# Altium project PCB_Project1.PrjPCB
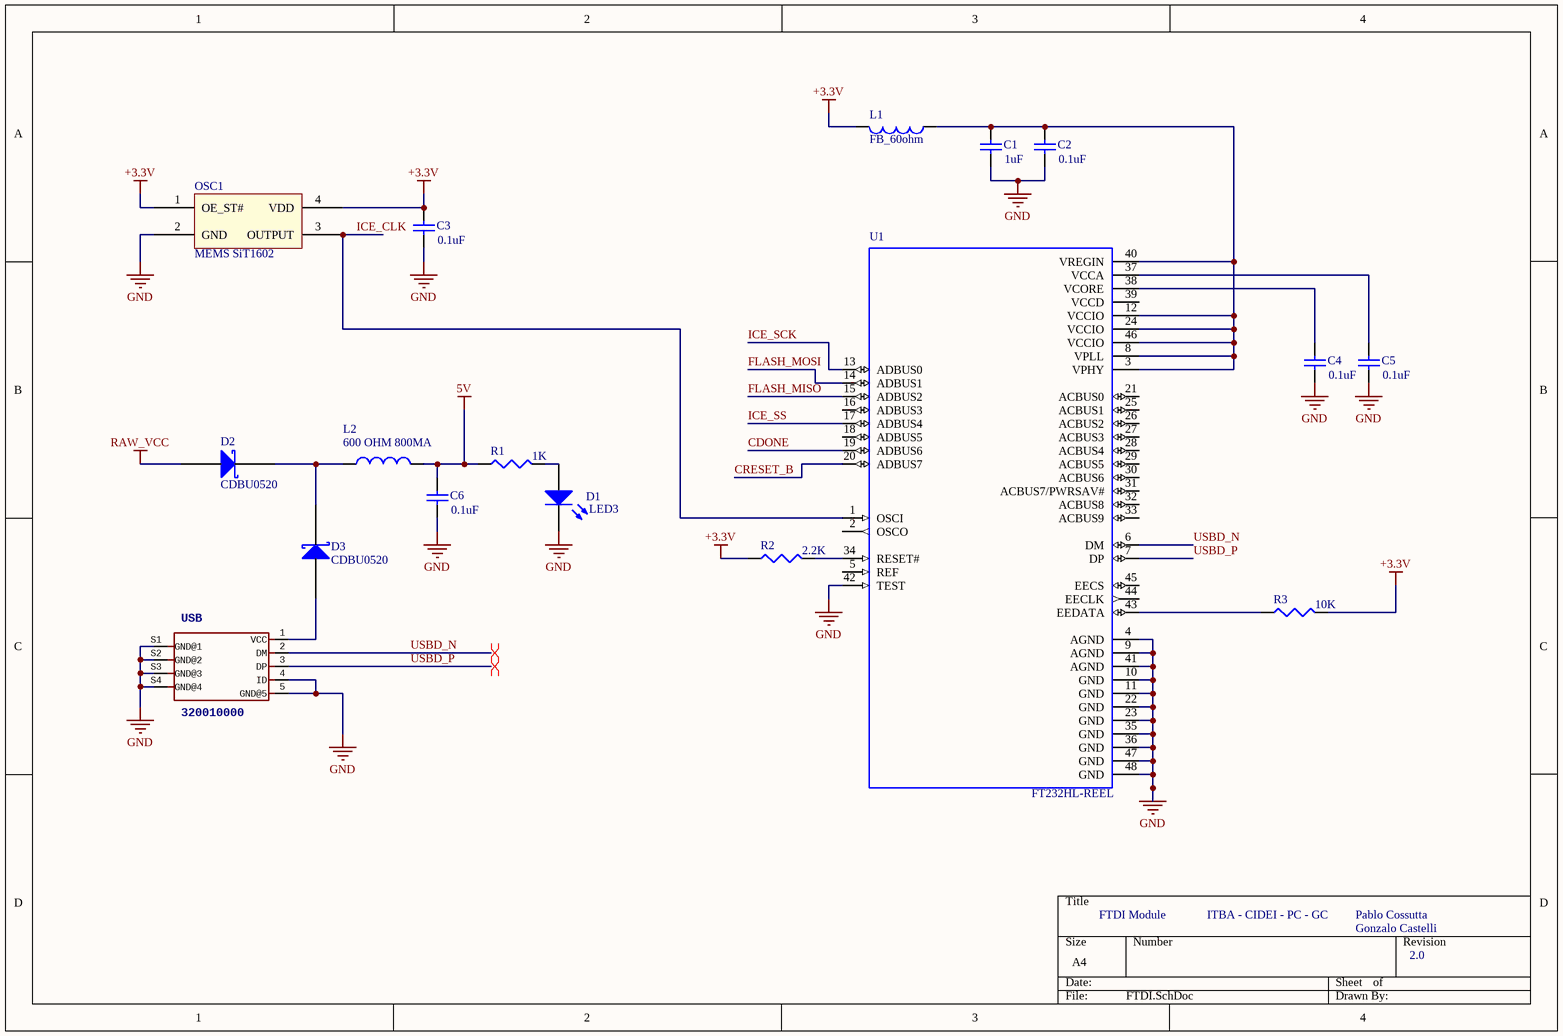
[diagram p0: FTDI.SchDoc]
3 sheets, 56 parts. Net scope: global (net labels, ports and power ports of the same name join across sheets).
Board file: FPGA.PcbDoc
Sheets:
  FTDI.SchDoc
  Misc.SchDoc
  FPGA.SchDoc

## Sheet FTDI.SchDoc
size A4; PageSetup: Record=PageOptions|CenterHorizontal=True|CenterVertical=True|PrintScale=1.00|XCorrection=1.00|YCorrection=1.00|PrintKind=2|BorderSize=5000000|LeftOffset=0|BottomOffset=0|Orientation=2|PaperLength=1000|PaperWidth=1000|Scale=100|PaperSource=7|PrintQuality=-3|MediaType=1|DitherType=10|PrintScaleMode=1|PaperKind=A4|PaperIndex=9

### Parts
C1  value 1uF  [C0402]  (hidden comment: Cap Semi)
C2  value 0.1uF  [C0402]  (hidden comment: Cap Semi)
C3  value 0.1uF  [C0402]  (hidden comment: Cap Semi)
C4  value 0.1uF  [C0402]  (hidden comment: Cap Semi)
C5  value 0.1uF  [C0402]  (hidden comment: Cap Semi)
C6  value 0.1uF  [C0402]  (hidden comment: Cap Semi)
D1  LED3  [LED-0603]
D2  CDBU0520  [CDBU0520]
D3  CDBU0520  [CDBU0520]
L1  FB_60ohm  [J1-0603]
L2  600 OHM 800MA  [J1-0603]
OSC1  MEMS SiT1602  [oscMEMS1602]
R1  value 1K  [R0402]  (hidden comment: Res3)
R2  value 2.2K  [R0402]  (hidden comment: Res3)
R3  value 10K  [R0402]  (hidden comment: Res3)
U1  FT232HL-REEL  [QFP50P900X900X160-48N]
USB  320010000  [MICRO-USB5+4P-SMD-0.65-B]

### Nets
5V: C6.2 L2.2 R1.1
+3.3V: C3.2 L1.2 OSC1.1(OE_ST#) OSC1.4(VDD) R2.1 R3.2
GND: C1.1 C2.1 C3.1 C4.1 C5.1 C6.1 D1.2(K) OSC1.2(GND) U1.4(AGND) U1.9(AGND) U1.10(GND) U1.11(GND) U1.22(GND) U1.23(GND) U1.35(GND) U1.36(GND) U1.41(AGND) U1.42(TEST) U1.47(GND) U1.48(GND) USB.4(ID) USB.5(GND@5) USB.S1(GND@1) USB.S2(GND@2) USB.S3(GND@3) USB.S4(GND@4)
RAW_VCC: D2.1
CDONE: U1.19(ADBUS6)
CRESET_B: U1.20(ADBUS7)
FLASH_MISO: U1.15(ADBUS2)
FLASH_MOSI: U1.14(ADBUS1)
ICE_CLK: OSC1.3(OUTPUT) U1.1(OSCI)
ICE_SCK: U1.13(ADBUS0)
ICE_SS: U1.17(ADBUS4)
USBD_N: U1.6(DM) USB.2(DM)
USBD_P: U1.7(DP) USB.3(DP)
NetC1_2: C1.2 C2.2 L1.1 U1.3(VPHY) U1.8(VPLL) U1.12(VCCIO) U1.24(VCCIO) U1.40(VREGIN) U1.46(VCCIO)
NetC4_2: C4.2 U1.38(VCORE)
NetC5_2: C5.2 U1.37(VCCA)
NetD1_1: D1.1(A) R1.2
NetD2_2: D2.2 D3.2 L2.1
NetD3_1: D3.1 USB.1(VCC)
NetR2_2: R2.2 U1.34(RESET#)
NetR3_1: R3.1 U1.43(EEDATA)

Not connected (* = marked no-connect by the designer): U1 2(OSCO) 5(REF) 16(ADBUS3) 18(ADBUS5) 21(ACBUS0) 25(ACBUS1) 26(ACBUS2) 27(ACBUS3) 28(ACBUS4) 29(ACBUS5) 30(ACBUS6) 31(ACBUS7/PWRSAV#) 32(ACBUS8) 33(ACBUS9) 39(VCCD) 44(EECLK) 45(EECS)

### Layout directives
differential pair: USBD_N, USBD_P

### Notes on the sheet
- FTDI Module
- ITBA - CIDEI - PC - GC
- Pablo Cossutta
- Gonzalo Castelli
- 2.0

### Library data of the parts
C1 = Cap Semi: Capacitor (Semiconductor SIM Model); Manufacturer: TDK Corporation; Manufacturer Part Number: CGB2A1JB1E105M033BC; Tolerance: ±20%; Voltage - Rated: 25V; Temperature Coefficient: JB; Notification: Current market demand for these product types have resulted in fluctuating and extending lead times. Lead times may differ.; Published: 8-Jun-2000; LatestRevisionDate: 29-May-2009; LatestRevisionNote: IPC-7351 Footprint Added.; PackageReference: C1206; Publisher: Altium Limited; PackageDescription: Chip Capacitor; Supplier 1: Digi-Key; Supplier Part Number 1: 445-12016-1-ND; RoHS: RoHS Compliant; Category: Capacitors; Stock 1: 0; Pricing 1: 1=0.25, 10=0.173, 100=0.0874, 500=0.0598, 1000=0.0529, 2500=0.0506, 5000=0.046 (USD); Packaging: Cut Tape (CT); Part Status: Active; Operating Temperature: -25°C ~ 85°C; Features: Low Profile; Ratings: -; Applications: General Purpose; Failure Rate: -; Mounting Type: Surface Mount, MLCC; Package / Case: 0402 (1005 Metric); Size / Dimension: 0.039" L x 0.020" W (1.00mm x 0.50mm); Height - Seated (Max): -; Thickness (Max): 0.013" (0.33mm); Lead Spacing: -; Lead Style: -; ComponentLink1URL: https://product.tdk.com/info/en/catalog/datasheets/mlcc_commercial_lowprofile_en.pdf; ComponentLink1Description: https://product.tdk.com/info/en/catalog/datasheets/mlcc_commercial_lowprofile_en.pdf
C2-C6 = Cap Semi: Capacitor (Semiconductor SIM Model); Manufacturer: Samsung Electro-Mechanics; Manufacturer Part Number: CL05B104KA5NNNC; Tolerance: ±10%; Voltage - Rated: 25V; Temperature Coefficient: X7R; Notification: Current market demand for these product types have resulted in fluctuating and extending lead times. Lead times may differ.; Published: 8-Jun-2000; LatestRevisionDate: 29-May-2009; LatestRevisionNote: IPC-7351 Footprint Added.; PackageReference: C1206; Publisher: Altium Limited; PackageDescription: Chip Capacitor; Supplier 1: Digi-Key; Supplier Part Number 1: 1276-6720-1-ND; RoHS: RoHS Compliant; Category: Capacitors; Stock 1: 0; Pricing 1: 1=0.1, 10=0.071, 100=0.0317, 500=0.02262, 1000=0.01777, 2500=0.01616, 5000=0.01486 (USD); Packaging: Cut Tape (CT); Part Status: Active; Operating Temperature: -55°C ~ 125°C; Features: -; Ratings: -; Applications: General Purpose; Mounting Type: Surface Mount, MLCC; Package / Case: 0402 (1005 Metric); Size / Dimension: 0.039" L x 0.020" W (1.00mm x 0.50mm); Height - Seated (Max): -; Thickness (Max): 0.022" (0.55mm); Lead Spacing: -; Lead Style: -; ComponentLink1URL: http://www.samsungsem.com/kr/support/product-search/mlcc/CL05B104KA5NNNC.jsp; ComponentLink1Description: http://www.samsungsem.com/kr/support/product-search/mlcc/CL05B104KA5NNNC.jsp
D1 = LED3: Typical BLUE SiC LED; pin to pad: 1>+ 2>-; Manufacturer: Lite-On Inc.; Manufacturer Part Number: LTST-C190TBKT; Configuration: Standard; Lens Color: Colorless; Lens Transparency: Clear; Millicandela Rating: 104mcd; Lens Style: Rectangle with Flat Top; Lens Size: 1.10mm x 0.80mm; Voltage - Forward (Vf) (Typ): 3.3V; Current - Test: 20mA; Viewing Angle: 130°; Wavelength - Dominant: 470nm; Wavelength - Peak: 468nm; Published: 8-Jun-2000; LatestRevisionDate: 17-Dec-2003; LatestRevisionNote: PCB Footprint replaced.; DatasheetVersion: 16-Apr-2002; PackageVersion: 16-Apr-2002; PackageReference: 3.5X2.8X1.9; Publisher: Altium Limited; PackageDescription: SM LED; 2 C-Bend Leads; Body 3.5 x 2.8 x 1.9 mm, inc leads (LxWxH typ); Supplier 1: Digi-Key; Supplier Part Number 1: 160-1646-1-ND; RoHS: RoHS Compliant; Category: Optoelectronics; Stock 1: 732613; Pricing 1: 1=0.55, 10=0.4, 25=0.3088, 100=0.2043, 250=0.15204, 500=0.13024, 1000=0.10847 (USD); Packaging: Cut Tape (CT); Part Status: Active; Color: Blue; Mounting Type: Surface Mount; Features: -; Package / Case: 0603 (1608 Metric); Supplier Device Package: Chip LED; Size / Dimension: 1.60mm L x 0.80mm W; Height (Max): 0.90mm; ComponentLink1URL: http://optoelectronics.liteon.com/upload/download/DS-22-99-0224/LTST-C190TBKT.PDF; ComponentLink1Description: http://optoelectronics.liteon.com/upload/download/DS-22-99-0224/LTST-C190TBKT.PDF
D2 D3 = CDBU0520: DIODE SCHOTTKY 20V 500MA 0603; pin to pad: 1>+ 2>-; Manufacturer: Comchip Technology; Speed: Fast Recovery =< 500ns, > 200mA (Io); Capacitance @ Vr, F: 100pF @ 0V, 1MHz; Packaging: Cut Tape (CT); Base Part Number: CDBU0520; Operating Temperature - Junction: 125°C (Max); Category: Discrete Semiconductor Products; Diode Type: Schottky; Supplier Device Package: 0603/SOD-523F; Package / Case: 2-SMD, No Lead; Mounting Type: Surface Mount; Manufacturer Part Number: CDBU0520; RoHS: RoHS Compliant; Part Status: Active; Current - Average Rectified (Io): 500mA; ComponentLink1URL: http://www.comchiptech.com/admin/files/product/CDBU0520-HF-RevA797161.pdf; ComponentLink1Description: http://www.comchiptech.com/admin/files/product/CDBU0520-HF-RevA797161.pdf; Supplier 1: Digi-Key; Stock 1: 262344; Pricing 1: 1=0.47, 10=0.333, 100=0.2186, 500=0.12916, 1000=0.09935 (USD); Supplier Part Number 1: 641-1332-1-ND
L1 = Inductor: Manufacturer: Laird-Signal Integrity Products; Manufacturer Part Number: HI0603P600R-10; Code_IEC: 1005; Value: 10mH; Filter Type: Power, Signal Line; Current Rating (Max): 4A; DC Resistance (DCR) (Max): 30 mOhm; Published: 8-Jun-2000; LatestRevisionDate: 29-May-2009; LatestRevisionNote: IPC-7351 Footprint Added.; PackageReference: 0402-A; Publisher: Altium Limited; PackageDescription: Chip Inductor; Code_JEITA: 0402; Supplier 1: Digi-Key; Supplier Part Number 1: 240-2376-1-ND; RoHS: RoHS Compliant; Category: Filters; Stock 1: 175172; Pricing 1: 1=0.19, 10=0.156, 25=0.1224, 50=0.1016, 100=0.088, 250=0.07088, 500=0.06402, 1000=0.05375 (USD); Packaging: Cut Tape (CT); Part Status: Active; Ratings: -; Operating Temperature: -40°C ~ 125°C; Package / Case: 0603 (1608 Metric); Mounting Type: Surface Mount; Height (Max): 0.037" (0.95mm); Size / Dimension: 0.063" L x 0.032" W (1.60mm x 0.80mm); ComponentLink1URL: http://assets.lairdtech.com/home/brandworld/files/HI0603P600R-10.pdf; ComponentLink1Description: http://assets.lairdtech.com/home/brandworld/files/HI0603P600R-10.pdf
L2 = Inductor: Manufacturer: Murata Electronics North America; Manufacturer Part Number: BLM18HE601SN1D; Code_IEC: 1005; Value: 10mH; Filter Type: Signal Line; DC Resistance (DCR) (Max): 250 mOhm; Published: 8-Jun-2000; LatestRevisionDate: 29-May-2009; LatestRevisionNote: IPC-7351 Footprint Added.; PackageReference: 0402-A; Publisher: Altium Limited; PackageDescription: Chip Inductor; Code_JEITA: 0402; Supplier 1: Digi-Key; Supplier Part Number 1: 490-5214-1-ND; RoHS: RoHS Compliant; Category: Filters; Stock 1: 152784; Pricing 1: 1=0.22, 10=0.179, 25=0.1392, 50=0.1154, 100=0.0996, 250=0.07964, 500=0.07168, 1000=0.05973 (USD); Packaging: Cut Tape (CT); Part Status: Active; Current Rating (Max): 800mA; Ratings: -; Operating Temperature: -55°C ~ 125°C; Package / Case: 0603 (1608 Metric); Mounting Type: Surface Mount; Height (Max): 0.037" (0.95mm); Size / Dimension: 0.063" L x 0.032" W (1.60mm x 0.80mm); ComponentLink1URL: https://www.murata.com/en-us/products/productdata/8796741599262/ENFA0004.pdf; ComponentLink1Description: https://www.murata.com/en-us/products/productdata/8796741599262/ENFA0004.pdf
OSC1 = SIT1602AC-13-33E-12.000000G: MEMS OSC XO 12.0000MHZ LVCMOS; Manufacturer: SiTIME; Function: Enable/Disable; Voltage - Supply: 3.3V; Frequency Stability: ±50ppm; Current - Supply (Max): 4.5mA; Current - Supply (Disable) (Max): 4mA; Supplier 1: Digi-Key; Manufacturer Part Number: SIT1602AC-13-33E-12.000000G; RoHS: RoHS Compliant; Category: Crystals, Oscillators, Resonators; Packaging: Cut Tape (CT); Part Status: Not For New Designs; Base Resonator: MEMS; Type: XO (Standard); Output: LVCMOS; Operating Temperature: -20°C ~ 70°C; Ratings: -; Mounting Type: Surface Mount; Package / Case: 4-SMD, No Lead; Size / Dimension: 0.098" L x 0.079" W (2.50mm x 2.00mm); Height - Seated (Max): 0.032" (0.80mm); ComponentLink1URL: https://media.digikey.com/pdf/Data%20Sheets/SiTime%20PDFs/SIT1602A.pdf; ComponentLink1Description: https://media.digikey.com/pdf/Data%20Sheets/SiTime%20PDFs/SIT1602A.pdf; Supplier Part Number 1: 1473-1051-1-ND; Pricing 1: 1=1.26, 10=1.118, 50=1.045, 100=0.9236 (USD)
R1 = Res3: Resistor; Manufacturer: Yageo; Manufacturer Part Number: RC0402JR-071KL; Tolerance: ±5%; Power (Watts): 0.063W, 1/16W; Temperature Coefficient: ±100ppm/°C; Published: 8-Jun-2000; LatestRevisionDate: 29-May-2009; LatestRevisionNote: IPC-7351 Footprint Added.; PackageReference: J1-0603; Publisher: Altium Limited; PackageDescription: Chip Resistor; Supplier 1: Digi-Key; Supplier Part Number 1: 311-1.0KJRCT-ND; RoHS: RoHS Compliant; Category: Resistors; Stock 1: 17587061; Pricing 1: 1=0.1, 10=0.015, 100=0.0062, 1000=0.0029, 2500=0.00255, 5000=0.00214 (USD); Packaging: Cut Tape (CT); Part Status: Active; Composition: Thick Film; Features: Moisture Resistant; Operating Temperature: -55°C ~ 155°C; Package / Case: 0402 (1005 Metric); Supplier Device Package: 0402; Size / Dimension: 0.039" L x 0.020" W (1.00mm x 0.50mm); Height - Seated (Max): 0.016" (0.40mm); Failure Rate: -; ComponentLink1URL: http://www.yageo.com/documents/recent/PYu-RC_Group_51_RoHS_L_9.pdf; ComponentLink1Description: http://www.yageo.com/documents/recent/PYu-RC_Group_51_RoHS_L_9.pdf
R2 = Res3: Resistor; Manufacturer: Yageo; Manufacturer Part Number: RC0402FR-072K2L; Tolerance: ±1%; Power (Watts): 0.063W, 1/16W; Temperature Coefficient: ±100ppm/°C; Published: 8-Jun-2000; LatestRevisionDate: 29-May-2009; LatestRevisionNote: IPC-7351 Footprint Added.; PackageReference: J1-0603; Publisher: Altium Limited; PackageDescription: Chip Resistor; Supplier 1: Digi-Key; Supplier Part Number 1: 311-2.20KLRCT-ND; RoHS: RoHS Compliant; Category: Resistors; Stock 1: 13607175; Pricing 1: 1=0.1, 10=0.018, 100=0.0076, 1000=0.00356, 2500=0.00313, 5000=0.00263 (USD); Packaging: Cut Tape (CT); Part Status: Active; Composition: Thick Film; Features: Moisture Resistant; Operating Temperature: -55°C ~ 155°C; Package / Case: 0402 (1005 Metric); Supplier Device Package: 0402; Size / Dimension: 0.039" L x 0.020" W (1.00mm x 0.50mm); Height - Seated (Max): 0.016" (0.40mm); Failure Rate: -; ComponentLink1URL: http://www.yageo.com/documents/recent/PYu-RC_Group_51_RoHS_L_9.pdf; ComponentLink1Description: http://www.yageo.com/documents/recent/PYu-RC_Group_51_RoHS_L_9.pdf
R3 = Res3: Resistor; Manufacturer: Yageo; Manufacturer Part Number: RC0402JR-0710KP; Tolerance: ±5%; Power (Watts): 0.063W, 1/16W; Temperature Coefficient: ±150ppm/°C; Published: 8-Jun-2000; LatestRevisionDate: 29-May-2009; LatestRevisionNote: IPC-7351 Footprint Added.; PackageReference: J1-0603; Publisher: Altium Limited; PackageDescription: Chip Resistor; Supplier 1: Digi-Key; Supplier Part Number 1: YAG1281CT-ND; RoHS: RoHS Compliant; Category: Resistors; Stock 1: 0; Pricing 1: 1=0.1, 10=0.028, 100=0.0119, 1000=0.00557, 2500=0.0049, 5000=0.00411 (USD); Packaging: Cut Tape (CT); Part Status: Active; Composition: Thick Film; Features: Moisture Resistant; Operating Temperature: -55°C ~ 155°C; Package / Case: 0402 (1005 Metric); Supplier Device Package: 0402; Size / Dimension: 0.039" L x 0.020" W (1.00mm x 0.50mm); Height - Seated (Max): 0.016" (0.40mm); Failure Rate: -; ComponentLink1URL: http://www.yageo.com/NewPortal/yageodocoutput?fileName=/pdf/R-Chip/PYu-RC_51_RoHS_P_0.pdf; ComponentLink1Description: http://www.yageo.com/NewPortal/yageodocoutput?fileName=/pdf/R-Chip/PYu-RC_51_RoHS_P_0.pdf
U1 = FT232HL-REEL: IC HS USB TO UART/FIFO 48LQFP; Manufacturer: FTDI, Future Technology Devices International Ltd; Current - Supply: 24mA; Standards: USB 2.0; Interface: UART, FIFO; Function: Bridge, USB to UART,FIFO; Voltage - Supply: 1.62 V ~ 1.98 V, 2.97 V ~ 3.63 V; Category: Integrated Circuits (ICs); Protocol: USB; Packaging: Cut Tape (CT); Manufacturer Part Number: FT232HL-REEL; RoHS: RoHS Compliant; Part Status: Active; Supplier Device Package: 48-LQFP (7x7); Package / Case: 48-LQFP; Operating Temperature: -40°C ~ 85°C; ComponentLink1URL: http://www.ftdichip.com/Support/Documents/DataSheets/ICs/DS_FT232H.pdf; ComponentLink1Description: http://www.ftdichip.com/Support/Documents/DataSheets/ICs/DS_FT232H.pdf; Supplier 1: Digi-Key; Stock 1: 26343; Pricing 1: 1=4.25, 10=3.55, 100=3.1, 250=2.95, 500=2.85002 (USD); Supplier Part Number 1: 768-1101-1-ND
USB = USB MICRO B: CONN USB MICRO B RECPT SMT R/A; Manufacturer: Amphenol FCI; Manufacturer Part Number: 10118193-0001LF; Connector Type: USB - micro B; Number of Contacts: 5; Gender: Receptacle; Specifications: USB 2.0; Current Rating: 1.8A per Contact; Voltage - Rated: 100VAC; Mating Cycles: 10000; Shielding: Shielded; Material Flammability Rating: UL94 V-0; Supplier 1: Digi-Key; RoHS: RoHS Compliant; Category: Connectors, Interconnects; Stock 1: 275888; Packaging: Cut Tape (CT); Part Status: Active; Mounting Type: Surface Mount, Right Angle; Through Hole; Mounting Feature: Horizontal; Termination: Solder; Features: Solder Retention; Ingress Protection: -; Operating Temperature: -30°C ~ 80°C; Contact Finish: Gold; Shell/Shielding Material: Steel, Stainless; Insulation Color: Black; ComponentLink1URL: http://www.amphenol-icc.com/media/wysiwyg/files/drawing/10118193.pdf; ComponentLink1Description: http://www.amphenol-icc.com/media/wysiwyg/files/drawing/10118193.pdf; Supplier Part Number 1: 609-4616-1-ND; Pricing 1: 1=0.45, 10=0.419, 25=0.38, 50=0.3406, 100=0.3275, 250=0.30132, 500=0.28822 (USD)

## Sheet Misc.SchDoc
size A4
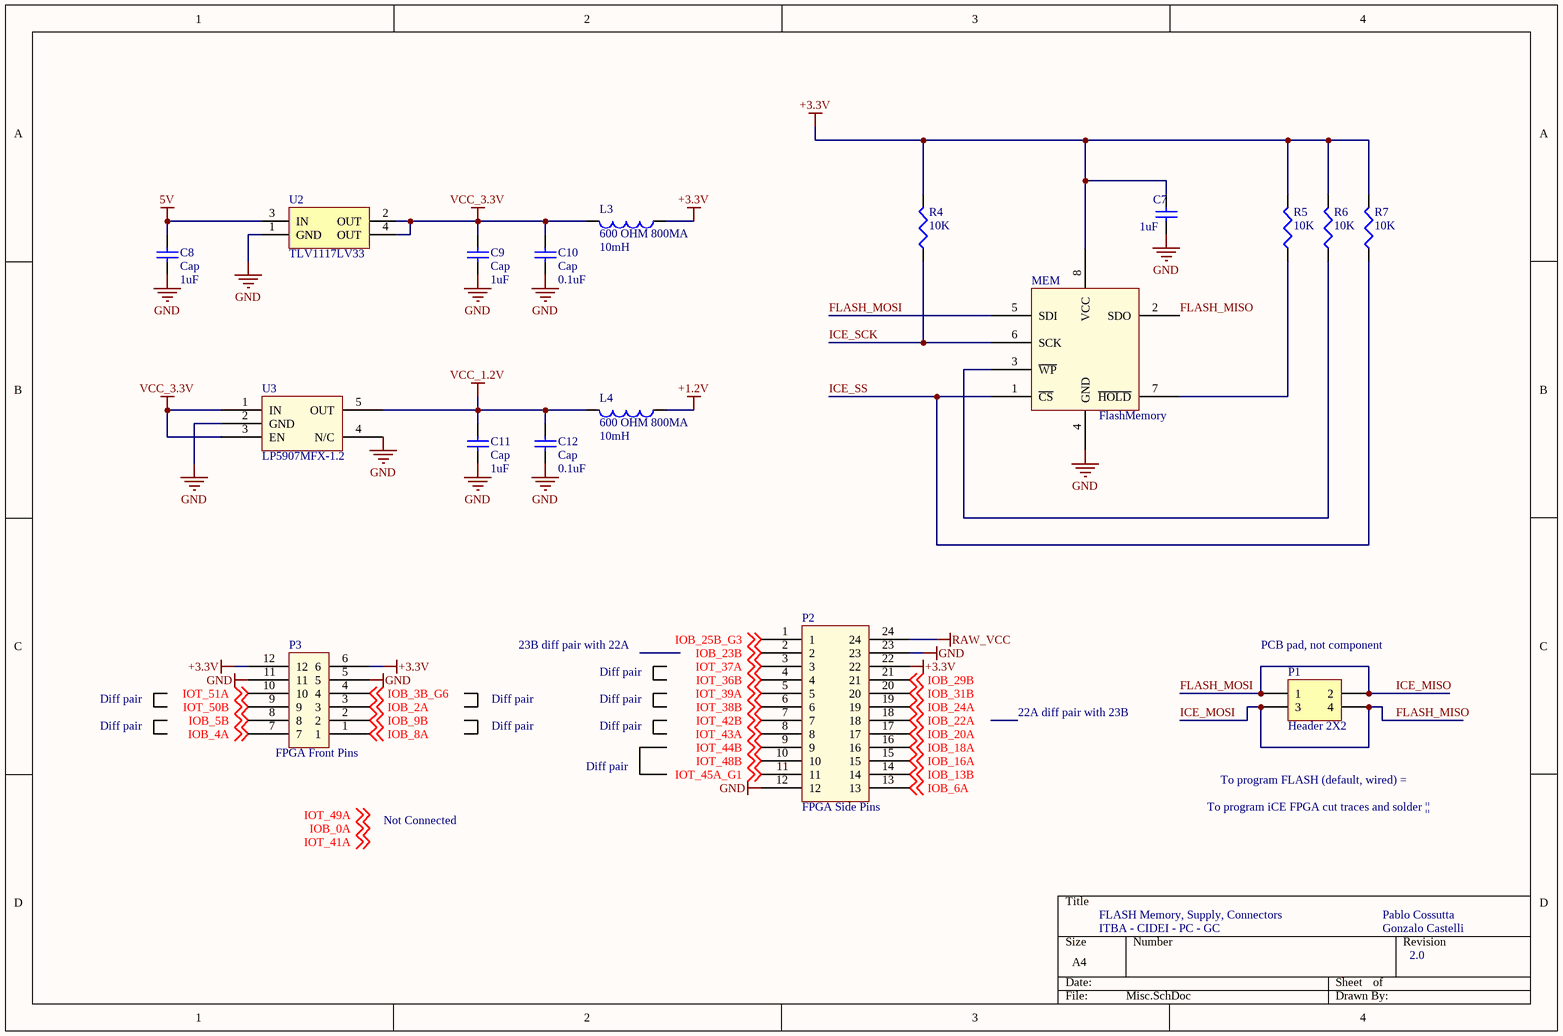
[diagram p1: Misc.SchDoc]

### Parts
C7  value 1uF  [C0402]  (hidden comment: Cap Semi)
C8  Cap  value 1uF  [C0603]
C9  Cap  value 1uF  [C0603]
C10  Cap  value 0.1uF  [C0402]
C11  Cap  value 1uF  [C0402]
C12  Cap  value 0.1uF  [C0402]
L3  600 OHM 800MA  value 10mH  [J1-0603]
L4  600 OHM 800MA  value 10mH  [J1-0603]
MEM  FlashMemory  [SOP8FlashCorrect]
P1  Header 2X2  [4x4HeaderSq]
P2  FPGA Side Pins  [FPGA Side Pins]
P3  FPGA Front Pins  [FPGA FRONT PINS]
R4  value 10K  [R0402]  (hidden comment: Res3)
R5  value 10K  [R0402]  (hidden comment: Res3)
R6  value 10K  [R0402]  (hidden comment: Res3)
R7  value 10K  [R0402]  (hidden comment: Res3)
U2  TLV1117LV33  [ZZ311]
U3  LP5907MFX-1.2  [1-2Regulator]

### Nets
5V: C8.2 U2.3(IN)
+1.2V: L4.1
+3.3V: C7.2 L3.1 MEM.8(VCC) P2.22 P3.6 P3.12 R4.2 R5.2 R6.2 R7.2
GND: C7.1 C8.1 C9.1 C10.1 C11.1 C12.1 MEM.4(GND) P2.12 P2.23 P3.5 P3.11 U2.1(GND) U3.2(GND) U3.4(N/C)
RAW_VCC: P2.24
VCC_1.2V: C11.2 C12.2 L4.2 U3.5(OUT)
VCC_3.3V: C9.2 C10.2 L3.2 U2.2(OUT) U2.4(OUT) U3.1(IN) U3.3(EN)
FLASH_MISO: MEM.2(SDO) P1.3 P1.4  [also labelled ICE_MOSI]
FLASH_MOSI: MEM.5(SDI) P1.1 P1.2  [also labelled ICE_MISO]
ICE_SCK: MEM.6(SCK) R4.1
ICE_SS: MEM.1(~{CS}) R7.1
IOB_2A: P3.3 ; off-sheet IOB_2A  [project net IOB_2A_N]
IOB_3B_G6: P3.4 ; off-sheet IOB_3B_G6  [project net IOB_2A_P]
IOB_4A: P3.7 ; off-sheet IOB_4A  [project net IOB_4A_N]
IOB_5B: P3.8 ; off-sheet IOB_5B  [project net IOB_4A_P]
IOB_6A: P2.13 ; off-sheet IOB_6A
IOB_8A: P3.1 ; off-sheet IOB_8A  [project net IOB_8A_N]
IOB_9B: P3.2 ; off-sheet IOB_9B  [project net IOB_8A_P]
IOB_13B: P2.14 ; off-sheet IOB_13B
IOB_16A: P2.15 ; off-sheet IOB_16A
IOB_18A: P2.16 ; off-sheet IOB_18A
IOB_20A: P2.17 ; off-sheet IOB_20A
IOB_22A: P2.18 ; off-sheet IOB_22A  [project net IOB_23B_N]
IOB_23B: P2.2 ; off-sheet IOB_23B  [project net IOB_23B_P]
IOB_24A: P2.19 ; off-sheet IOB_24A
IOB_25B_G3: P2.1 ; off-sheet IOB_25B_G3
IOB_29B: P2.21 ; off-sheet IOB_29B
IOB_31B: P2.20 ; off-sheet IOB_31B
IOT_36B: P2.4 ; off-sheet IOT_36B  [project net IOT_37A_N]
IOT_37A: P2.3 ; off-sheet IOT_37A  [project net IOT_37A_P]
IOT_38B: P2.6 ; off-sheet IOT_38B  [project net IOT_39A_N]
IOT_39A: P2.5 ; off-sheet IOT_39A  [project net IOT_39A_P]
IOT_42B: P2.7 ; off-sheet IOT_42B  [project net IOT_43A_N]
IOT_43A: P2.8 ; off-sheet IOT_43A  [project net IOT_43A_P]
IOT_44B: P2.9 ; off-sheet IOT_44B  [project net IOT_44B_N]
IOT_45A_G1: P2.11 ; off-sheet IOT_45A_G1  [project net IOT_44B_P]
IOT_48B: P2.10 ; off-sheet IOT_48B  [project net IOT_49A_N]
IOT_50B: P3.9 ; off-sheet IOT_50B  [project net IOT_51A_N]
IOT_51A: P3.10 ; off-sheet IOT_51A  [project net IOT_51A_P]
NetMEM_3: MEM.3(~{WP}) R6.1
NetMEM_7: MEM.7(~{HOLD}) R5.1

### Notes on the sheet
- 23B diff pair with 22A
- (near P1) PCB pad, not component
- Diff pair
- 22A diff pair with 23B
- To program FLASH (default, wired) =
- Not Connected
- To program iCE FPGA cut traces and solder ||
- FLASH Memory, Supply, Connectors
- Pablo Cossutta
- ITBA - CIDEI - PC - GC
- Gonzalo Castelli
- 2.0
- Labels drawn without touching a wire or pin: IOB_0A, IOT_41A, IOT_49A

### Library data of the parts
C7 C11 = Cap Semi: as C1 on sheet FTDI; Published: 8-Jun-2000; LatestRevisionDate: 29-May-2009; LatestRevisionNote: IPC-7351 Footprint Added.; PackageReference: C1206; Publisher: Altium Limited; PackageDescription: Chip Capacitor; Supplier 1: Digi-Key; Supplier Part Number 1: 445-12016-1-ND; RoHS: RoHS Compliant; Category: Capacitors; Stock 1: 0; Pricing 1: 1=0.25, 10=0.173, 100=0.0874, 500=0.0598, 1000=0.0529, 2500=0.0506, 5000=0.046 (USD); Packaging: Cut Tape (CT); Part Status: Active; Operating Temperature: -25°C ~ 85°C; Features: Low Profile; Ratings: -; Applications: General Purpose; Failure Rate: -; Mounting Type: Surface Mount, MLCC; Package / Case: 0402 (1005 Metric); Size / Dimension: 0.039" L x 0.020" W (1.00mm x 0.50mm); Height - Seated (Max): -; Thickness (Max): 0.013" (0.33mm); Lead Spacing: -; Lead Style: -; ComponentLink1URL: https://product.tdk.com/info/en/catalog/datasheets/mlcc_commercial_lowprofile_en.pdf; ComponentLink1Description: https://product.tdk.com/info/en/catalog/datasheets/mlcc_commercial_lowprofile_en.pdf
C8 C9 = Cap Semi: Capacitor (Semiconductor SIM Model); Manufacturer: Yageo; Manufacturer Part Number: CC0603KRX5R8BB105; Tolerance: ±10%; Voltage - Rated: 25V; Temperature Coefficient: X5R; Notification: Current market demand for these product types have resulted in fluctuating and extending lead times. Lead times may differ.; Published: 8-Jun-2000; LatestRevisionDate: 29-May-2009; LatestRevisionNote: IPC-7351 Footprint Added.; PackageReference: C1206; Publisher: Altium Limited; PackageDescription: Chip Capacitor; Supplier 1: Digi-Key; Supplier Part Number 1: 311-1445-1-ND; RoHS: RoHS Compliant; Category: Capacitors; Stock 1: 40000; Pricing 1: 1=0.25, 10=0.179, 100=0.0843, 500=0.05908, 1000=0.04891 (USD); Packaging: Cut Tape (CT); Part Status: Active; Operating Temperature: -55°C ~ 85°C; Features: -; Ratings: -; Applications: General Purpose; Failure Rate: -; Mounting Type: Surface Mount, MLCC; Package / Case: 0603 (1608 Metric); Size / Dimension: 0.063" L x 0.031" W (1.60mm x 0.80mm); Height - Seated (Max): -; Thickness (Max): 0.035" (0.90mm); Lead Spacing: -; Lead Style: -; ComponentLink1URL: http://www.yageo.com/documents/recent/UPY-GPHC_X5R_4V-to-50V_25.pdf; ComponentLink1Description: http://www.yageo.com/documents/recent/UPY-GPHC_X5R_4V-to-50V_25.pdf
C10 C12 = Cap Semi: as C2 on sheet FTDI; Published: 8-Jun-2000; LatestRevisionDate: 29-May-2009; LatestRevisionNote: IPC-7351 Footprint Added.; PackageReference: C1206; Publisher: Altium Limited; PackageDescription: Chip Capacitor; Supplier 1: Digi-Key; Supplier Part Number 1: 1276-6720-1-ND; RoHS: RoHS Compliant; Category: Capacitors; Stock 1: 0; Pricing 1: 1=0.1, 10=0.071, 100=0.0317, 500=0.02262, 1000=0.01777, 2500=0.01616, 5000=0.01486 (USD); Packaging: Cut Tape (CT); Part Status: Active; Operating Temperature: -55°C ~ 125°C; Features: -; Ratings: -; Applications: General Purpose; Mounting Type: Surface Mount, MLCC; Package / Case: 0402 (1005 Metric); Size / Dimension: 0.039" L x 0.020" W (1.00mm x 0.50mm); Height - Seated (Max): -; Thickness (Max): 0.022" (0.55mm); Lead Spacing: -; Lead Style: -; ComponentLink1URL: http://www.samsungsem.com/kr/support/product-search/mlcc/CL05B104KA5NNNC.jsp; ComponentLink1Description: http://www.samsungsem.com/kr/support/product-search/mlcc/CL05B104KA5NNNC.jsp
L3 L4 = Inductor: Manufacturer: Murata Electronics North America; Manufacturer Part Number: BLM18HE601SN1D; Code_IEC: 1005; Filter Type: Signal Line; DC Resistance (DCR) (Max): 250 mOhm; Published: 8-Jun-2000; LatestRevisionDate: 29-May-2009; LatestRevisionNote: IPC-7351 Footprint Added.; PackageReference: 0402-A; Publisher: Altium Limited; PackageDescription: Chip Inductor; Code_JEITA: 0402; Supplier 1: Digi-Key; Supplier Part Number 1: 490-5214-1-ND; RoHS: RoHS Compliant; Category: Filters; Stock 1: 152784; Pricing 1: 1=0.22, 10=0.179, 25=0.1392, 50=0.1154, 100=0.0996, 250=0.07964, 500=0.07168, 1000=0.05973 (USD); Packaging: Cut Tape (CT); Part Status: Active; Current Rating (Max): 800mA; Ratings: -; Operating Temperature: -55°C ~ 125°C; Package / Case: 0603 (1608 Metric); Mounting Type: Surface Mount; Height (Max): 0.037" (0.95mm); Size / Dimension: 0.063" L x 0.032" W (1.60mm x 0.80mm); ComponentLink1URL: https://www.murata.com/en-us/products/productdata/8796741599262/ENFA0004.pdf; ComponentLink1Description: https://www.murata.com/en-us/products/productdata/8796741599262/ENFA0004.pdf
MEM = W25Q32JVSSIQ: IC FLASH 32M SPI 133MHZ 8SOIC; Manufacturer: Winbond Electronics; Memory Type: Non-Volatile; Write Cycle Time - Word, Page: 3ms; Voltage - Supply: 2.7 V ~ 3.6 V; Memory Interface: SPI - Quad I/O; Memory Size: 32Mb (4M x 8); Memory Format: FLASH; RoHS: RoHS Compliant; Manufacturer Part Number: W25Q32JVSSIQ; Technology: FLASH - NOR; Part Status: Active; Packaging: Tube; Category: Integrated Circuits (ICs); Supplier Device Package: 8-SOIC; Mounting Type: Surface Mount; Operating Temperature: -40°C ~ 85°C (TA); Package / Case: 8-SOIC (0.209", 5.30mm Width); ComponentLink1URL: http://www.winbond.com/resource-files/w25q32jv%20revg%2003272018%20plus.pdf; ComponentLink1Description: http://www.winbond.com/resource-files/w25q32jv%20revg%2003272018%20plus.pdf; Supplier 1: Digi-Key; Stock 1: 41181; Pricing 1: 1=0.81, 10=0.74, 25=0.7308, 90=0.72667, 180=0.64972, 270=0.64411, 540=0.63474, 810=0.62498, 1080=0.61183 (USD); Supplier Part Number 1: W25Q32JVSSIQ-ND
P1 = Header 2X2: Header, 2-Pin, Dual row; Not Populated: True; LatestRevisionDate: 17-Jul-2002; LatestRevisionNote: Re-released for DXP Platform.; Publisher: Altium Limited; Pricing 1: 0
R4-R7 = Res3: as R3 on sheet FTDI; Published: 8-Jun-2000; LatestRevisionDate: 29-May-2009; LatestRevisionNote: IPC-7351 Footprint Added.; PackageReference: J1-0603; Publisher: Altium Limited; PackageDescription: Chip Resistor; Supplier 1: Digi-Key; Supplier Part Number 1: YAG1281CT-ND; RoHS: RoHS Compliant; Category: Resistors; Stock 1: 0; Pricing 1: 1=0.1, 10=0.028, 100=0.0119, 1000=0.00557, 2500=0.0049, 5000=0.00411 (USD); Packaging: Cut Tape (CT); Part Status: Active; Composition: Thick Film; Features: Moisture Resistant; Operating Temperature: -55°C ~ 155°C; Package / Case: 0402 (1005 Metric); Supplier Device Package: 0402; Size / Dimension: 0.039" L x 0.020" W (1.00mm x 0.50mm); Height - Seated (Max): 0.016" (0.40mm); Failure Rate: -; ComponentLink1URL: http://www.yageo.com/NewPortal/yageodocoutput?fileName=/pdf/R-Chip/PYu-RC_51_RoHS_P_0.pdf; ComponentLink1Description: http://www.yageo.com/NewPortal/yageodocoutput?fileName=/pdf/R-Chip/PYu-RC_51_RoHS_P_0.pdf
U2 = TLV1117LV33DCYR: IC REG LINEAR 3.3V 1A SOT223-4; Manufacturer: Texas Instruments; Output Configuration: Positive; Output Type: Fixed; Voltage - Input (Max): 5.5V; Voltage Dropout (Max): 1.3V @ 800mA; PSRR: 75dB (120Hz); Protection Features: Over Current, Over Temperature; ComponentLink1Description: http://www.ti.com/lit/ds/symlink/tlv1117lv.pdf; ComponentLink1URL: http://www.ti.com/lit/ds/symlink/tlv1117lv.pdf; Supplier 1: Digi-Key; Manufacturer Part Number: TLV1117LV33DCYR; RoHS: RoHS Compliant; Category: Integrated Circuits (ICs); Stock 1: 20855; Packaging: Cut Tape (CT); Part Status: Active; Voltage - Output (Min/Fixed): 3.3V; Voltage - Output (Max): -; Current - Output: 1A; Control Features: -; Operating Temperature: -40°C ~ 125°C; Mounting Type: Surface Mount; Package / Case: TO-261-4, TO-261AA; Supplier Device Package: SOT-223-4; Base Part Number: TLV1117LV33; Supplier Part Number 1: 296-28778-1-ND; Pricing 1: 1=0.68, 10=0.598, 100=0.4586, 500=0.36256, 1000=0.29005 (USD)
U3 = LP5907MFX-1.2/NOPB: IC REG LINEAR 1.2V 250MA SOT23-5; Manufacturer: Texas Instruments; Output Configuration: Positive; Output Type: Fixed; Voltage - Input (Max): 5.5V; Voltage Dropout (Max): 0.25V @ 250mA; PSRR: 90dB ~ 60dB (100Hz ~ 100kHz); Control Features: Enable; Protection Features: Over Temperature, Short Circuit; Supplier 1: Digi-Key; Manufacturer Part Number: LP5907MFX-1.2/NOPB; RoHS: RoHS Compliant; Category: Integrated Circuits (ICs); Stock 1: 65117; Packaging: Cut Tape (CT); Part Status: Active; Voltage - Output (Min/Fixed): 1.2V; Voltage - Output (Max): -; Current - Output: 250mA; Operating Temperature: -40°C ~ 125°C; Mounting Type: Surface Mount; Package / Case: SC-74A, SOT-753; Supplier Device Package: SOT-23-5; ComponentLink1URL: http://www.ti.com/lit/ds/symlink/lp5907.pdf; ComponentLink1Description: http://www.ti.com/lit/ds/symlink/lp5907.pdf; Supplier Part Number 1: 296-39062-1-ND; Pricing 1: 1=0.55, 10=0.475, 100=0.3547, 500=0.27872, 1000=0.21537 (USD)

## Sheet FPGA.SchDoc
size A4
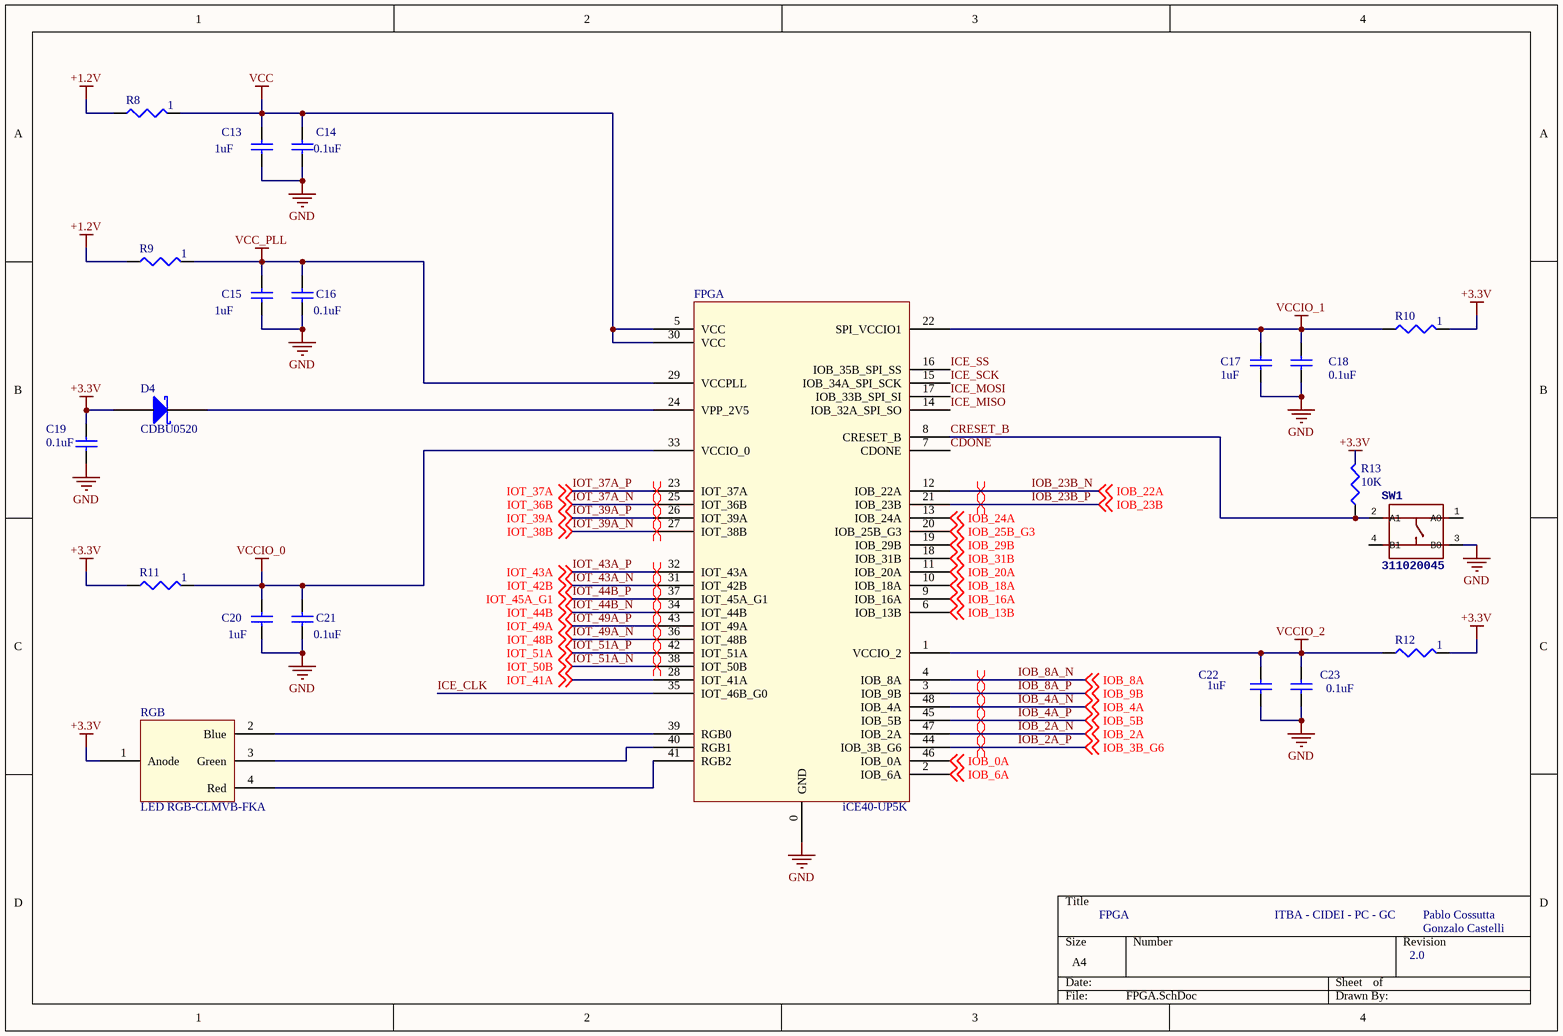
[diagram p2: FPGA.SchDoc]

### Parts
C13  value 1uF  [C0402]  (hidden comment: Cap Semi)
C14  value 0.1uF  [C0402]  (hidden comment: Cap Semi)
C15  value 1uF  [C0402]  (hidden comment: Cap Semi)
C16  value 0.1uF  [C0402]  (hidden comment: Cap Semi)
C17  value 1uF  [C0402]  (hidden comment: Cap Semi)
C18  value 0.1uF  [C0402]  (hidden comment: Cap Semi)
C19  value 0.1uF  [C0402]  (hidden comment: Cap Semi)
C20  value 1uF  [C0402]  (hidden comment: Cap Semi)
C21  value 0.1uF  [C0402]  (hidden comment: Cap Semi)
C22  value 1uF  [C0402]  (hidden comment: Cap Semi)
C23  value 0.1uF  [C0402]  (hidden comment: Cap Semi)
D4  CDBU0520  [CDBU0520]
FPGA  iCE40-UP5K  [SLAB-QFN48-7X7-MD]
R8  value 1  [R0402]  (hidden comment: Res3)
R9  value 1  [R0402]  (hidden comment: Res3)
R10  value 1  [R0402]  (hidden comment: Res3)
R11  value 1  [R0402]  (hidden comment: Res3)
R12  value 1  [R0402]  (hidden comment: Res3)
R13  value 10K  [R0402]  (hidden comment: Res3)
RGB  LED RGB-CLMVB-FKA  [ledRGB]
SW1  311020045  [SW4-SMD-4.2X3.2X2.5MM]

### Nets
+1.2V: R8.1 R9.1
+3.3V: C19.2 D4.1 R10.2 R11.1 R12.2 R13.2 RGB.1(Anode)
GND: C13.1 C14.1 C15.1 C16.1 C17.1 C18.1 C19.1 C20.1 C21.1 C22.1 C23.1 FPGA.0(GND) SW1.3(B0)
VCC: C13.2 C14.2 FPGA.5(VCC) FPGA.30(VCC) R8.2
VCC_PLL: C15.2 C16.2 FPGA.29(VCCPLL) R9.2
VCCIO_0: C20.2 C21.2 FPGA.33(VCCIO_0) R11.2
VCCIO_1: C17.2 C18.2 FPGA.22(SPI_VCCIO1) R10.1
VCCIO_2: C22.2 C23.2 FPGA.1(VCCIO_2) R12.1
CDONE: FPGA.7(CDONE)
CRESET_B: FPGA.8(CRESET_B) R13.1 SW1.2(A1)
ICE_CLK: FPGA.35(IOT_46B_G0)
ICE_MISO: FPGA.14(IOB_32A_SPI_SO)  [project net FLASH_MOSI]
ICE_MOSI: FPGA.17(IOB_33B_SPI_SI)  [project net FLASH_MISO]
ICE_SCK: FPGA.15(IOB_34A_SPI_SCK)
ICE_SS: FPGA.16(IOB_35B_SPI_SS)
IOB_0A: FPGA.46(IOB_0A) ; off-sheet IOB_0A
IOB_2A_N: FPGA.47(IOB_2A) ; off-sheet IOB_2A  [also labelled IOB_2A]
IOB_2A_P: FPGA.44(IOB_3B_G6) ; off-sheet IOB_3B_G6  [also labelled IOB_3B_G6]
IOB_4A_N: FPGA.48(IOB_4A) ; off-sheet IOB_4A  [also labelled IOB_4A]
IOB_4A_P: FPGA.45(IOB_5B) ; off-sheet IOB_5B  [also labelled IOB_5B]
IOB_6A: FPGA.2(IOB_6A) ; off-sheet IOB_6A
IOB_8A_N: FPGA.4(IOB_8A) ; off-sheet IOB_8A  [also labelled IOB_8A]
IOB_8A_P: FPGA.3(IOB_9B) ; off-sheet IOB_9B  [also labelled IOB_9B]
IOB_13B: FPGA.6(IOB_13B) ; off-sheet IOB_13B
IOB_16A: FPGA.9(IOB_16A) ; off-sheet IOB_16A
IOB_18A: FPGA.10(IOB_18A) ; off-sheet IOB_18A
IOB_20A: FPGA.11(IOB_20A) ; off-sheet IOB_20A
IOB_23B_N: FPGA.12(IOB_22A) ; off-sheet IOB_22A  [also labelled IOB_22A]
IOB_23B_P: FPGA.21(IOB_23B) ; off-sheet IOB_23B  [also labelled IOB_23B]
IOB_24A: FPGA.13(IOB_24A) ; off-sheet IOB_24A
IOB_25B_G3: FPGA.20(IOB_25B_G3) ; off-sheet IOB_25B_G3
IOB_29B: FPGA.19(IOB_29B) ; off-sheet IOB_29B
IOB_31B: FPGA.18(IOB_31B) ; off-sheet IOB_31B
IOT_37A_N: FPGA.25(IOT_36B) ; off-sheet IOT_36B  [also labelled IOT_36B]
IOT_37A_P: FPGA.23(IOT_37A) ; off-sheet IOT_37A  [also labelled IOT_37A]
IOT_39A_N: FPGA.27(IOT_38B) ; off-sheet IOT_38B  [also labelled IOT_38B]
IOT_39A_P: FPGA.26(IOT_39A) ; off-sheet IOT_39A  [also labelled IOT_39A]
IOT_41A: FPGA.28(IOT_41A) ; off-sheet IOT_41A
IOT_43A_N: FPGA.31(IOT_42B) ; off-sheet IOT_42B  [also labelled IOT_42B]
IOT_43A_P: FPGA.32(IOT_43A) ; off-sheet IOT_43A  [also labelled IOT_43A]
IOT_44B_N: FPGA.34(IOT_44B) ; off-sheet IOT_44B  [also labelled IOT_44B]
IOT_44B_P: FPGA.37(IOT_45A_G1) ; off-sheet IOT_45A_G1  [also labelled IOT_45A_G1]
IOT_49A_N: FPGA.36(IOT_48B) ; off-sheet IOT_48B  [also labelled IOT_48B]
IOT_49A_P: FPGA.43(IOT_49A) ; off-sheet IOT_49A  [also labelled IOT_49A]
IOT_51A_N: FPGA.38(IOT_50B) ; off-sheet IOT_50B  [also labelled IOT_50B]
IOT_51A_P: FPGA.42(IOT_51A) ; off-sheet IOT_51A  [also labelled IOT_51A]
NetD4_2: D4.2 FPGA.24(VPP_2V5)
NetFPGA_39: FPGA.39(RGB0) RGB.2(Blue)
NetFPGA_40: FPGA.40(RGB1) RGB.3(Green)
NetFPGA_41: FPGA.41(RGB2) RGB.4(Red)

Not connected (* = marked no-connect by the designer): SW1 1(A0) 4(B1)

### Layout directives
differential pair: IOB_2A_N, IOB_2A_P, IOB_4A_N, IOB_4A_P, IOB_8A_N, IOB_8A_P, IOB_23B_N, IOB_23B_P, IOT_37A_N, IOT_37A_P, IOT_39A_N, IOT_39A_P, IOT_43A_N, IOT_43A_P, IOT_44B_N, IOT_44B_P, IOT_49A_N, IOT_49A_P, IOT_51A_N, IOT_51A_P

### Notes on the sheet
- FPGA
- ITBA - CIDEI - PC - GC
- Pablo Cossutta
- 2.0
- Gonzalo Castelli

### Library data of the parts
C13 C15 C17 C20 C22 = Cap Semi: as C1 on sheet FTDI; Published: 8-Jun-2000; LatestRevisionDate: 29-May-2009; LatestRevisionNote: IPC-7351 Footprint Added.; PackageReference: C1206; Publisher: Altium Limited; PackageDescription: Chip Capacitor; Supplier 1: Digi-Key; Supplier Part Number 1: 445-12016-1-ND; RoHS: RoHS Compliant; Category: Capacitors; Stock 1: 0; Pricing 1: 1=0.25, 10=0.173, 100=0.0874, 500=0.0598, 1000=0.0529, 2500=0.0506, 5000=0.046 (USD); Packaging: Cut Tape (CT); Part Status: Active; Operating Temperature: -25°C ~ 85°C; Features: Low Profile; Ratings: -; Applications: General Purpose; Failure Rate: -; Mounting Type: Surface Mount, MLCC; Package / Case: 0402 (1005 Metric); Size / Dimension: 0.039" L x 0.020" W (1.00mm x 0.50mm); Height - Seated (Max): -; Thickness (Max): 0.013" (0.33mm); Lead Spacing: -; Lead Style: -; ComponentLink1URL: https://product.tdk.com/info/en/catalog/datasheets/mlcc_commercial_lowprofile_en.pdf; ComponentLink1Description: https://product.tdk.com/info/en/catalog/datasheets/mlcc_commercial_lowprofile_en.pdf
C14 C16 C18 C19 C21 C23 = Cap Semi: as C2 on sheet FTDI; Published: 8-Jun-2000; LatestRevisionDate: 29-May-2009; LatestRevisionNote: IPC-7351 Footprint Added.; PackageReference: C1206; Publisher: Altium Limited; PackageDescription: Chip Capacitor; Supplier 1: Digi-Key; Supplier Part Number 1: 1276-6720-1-ND; RoHS: RoHS Compliant; Category: Capacitors; Stock 1: 0; Pricing 1: 1=0.1, 10=0.071, 100=0.0317, 500=0.02262, 1000=0.01777, 2500=0.01616, 5000=0.01486 (USD); Packaging: Cut Tape (CT); Part Status: Active; Operating Temperature: -55°C ~ 125°C; Features: -; Ratings: -; Applications: General Purpose; Mounting Type: Surface Mount, MLCC; Package / Case: 0402 (1005 Metric); Size / Dimension: 0.039" L x 0.020" W (1.00mm x 0.50mm); Height - Seated (Max): -; Thickness (Max): 0.022" (0.55mm); Lead Spacing: -; Lead Style: -; ComponentLink1URL: http://www.samsungsem.com/kr/support/product-search/mlcc/CL05B104KA5NNNC.jsp; ComponentLink1Description: http://www.samsungsem.com/kr/support/product-search/mlcc/CL05B104KA5NNNC.jsp
D4 = CDBU0520: DIODE SCHOTTKY 20V 500MA 0603; pin to pad: 1>+ 2>-; Manufacturer: Comchip Technology; Speed: Fast Recovery =< 500ns, > 200mA (Io); Capacitance @ Vr, F: 100pF @ 0V, 1MHz; Packaging: Cut Tape (CT); Base Part Number: CDBU0520; Operating Temperature - Junction: 125°C (Max); Category: Discrete Semiconductor Products; Diode Type: Schottky; Supplier Device Package: 0603/SOD-523F; Package / Case: 2-SMD, No Lead; Mounting Type: Surface Mount; Manufacturer Part Number: CDBU0520; RoHS: RoHS Compliant; Part Status: Active; Current - Average Rectified (Io): 500mA; ComponentLink1URL: http://www.comchiptech.com/admin/files/product/CDBU0520-HF-RevA797161.pdf; ComponentLink1Description: http://www.comchiptech.com/admin/files/product/CDBU0520-HF-RevA797161.pdf; Supplier 1: Digi-Key; Stock 1: 262344; Pricing 1: 1=0.47, 10=0.333, 100=0.2186, 500=0.12916, 1000=0.09935 (USD); Supplier Part Number 1: 641-1332-1-ND
FPGA = iCE40-UP5K FPGA: Manufacturer: Lattice Semiconductor Corporation; Manufacturer Part Number: ICE40UP5K-SG48ITR50; Voltage - Supply: 1.14 V ~ 1.26 V; Mounting Type: Surface Mount; Category: Integrated Circuits (ICs); Package / Case: 48-VFQFN Exposed Pad; Operating Temperature: -40°C ~ 100°C (TJ); Part Status: Discontinued at Digi-Key; RoHS: RoHS Compliant; Supplier Device Package: 48-QFN (7x7); ComponentLink1URL: http://www.latticesemi.com/view_document?document_id=51968; ComponentLink1Description: http://www.latticesemi.com/view_document?document_id=51968; Stock 1: 514; Supplier 1: Digi-Key; Pricing 1: 1=6.06 (USD); Supplier Part Number 1: 220-2145-1-ND
R8-R12 = Res3: Resistor; Manufacturer: Yageo; Manufacturer Part Number: AC0402JR-071RL; Tolerance: ±5%; Power (Watts): 0.063W, 1/16W; Temperature Coefficient: ±200ppm/°C; Published: 8-Jun-2000; LatestRevisionDate: 29-May-2009; LatestRevisionNote: IPC-7351 Footprint Added.; PackageReference: J1-0603; Publisher: Altium Limited; PackageDescription: Chip Resistor; Supplier 1: Digi-Key; Supplier Part Number 1: YAG3527CT-ND; RoHS: RoHS Compliant; Category: Resistors; Stock 1: 19312; Pricing 1: 1=0.1, 10=0.026, 100=0.0104, 1000=0.00469, 2500=0.00407, 5000=0.00336 (USD); Packaging: Cut Tape (CT); Part Status: Active; Composition: Thick Film; Features: Automotive AEC-Q200, Moisture Resistant; Operating Temperature: -55°C ~ 155°C; Package / Case: 0402 (1005 Metric); Supplier Device Package: 0402; Size / Dimension: 0.039" L x 0.020" W (1.00mm x 0.50mm); Height - Seated (Max): 0.015" (0.37mm); Failure Rate: -; ComponentLink1URL: http://www.yageo.com/NewPortal/yageodocoutput?fileName=/pdf/R-Chip/PYu-AC_51_RoHS_L_6.pdf; ComponentLink1Description: http://www.yageo.com/NewPortal/yageodocoutput?fileName=/pdf/R-Chip/PYu-AC_51_RoHS_L_6.pdf
R13 = Res3: as R3 on sheet FTDI; Published: 8-Jun-2000; LatestRevisionDate: 29-May-2009; LatestRevisionNote: IPC-7351 Footprint Added.; PackageReference: J1-0603; Publisher: Altium Limited; PackageDescription: Chip Resistor; Supplier 1: Digi-Key; Supplier Part Number 1: YAG1281CT-ND; RoHS: RoHS Compliant; Category: Resistors; Stock 1: 0; Pricing 1: 1=0.1, 10=0.028, 100=0.0119, 1000=0.00557, 2500=0.0049, 5000=0.00411 (USD); Packaging: Cut Tape (CT); Part Status: Active; Composition: Thick Film; Features: Moisture Resistant; Operating Temperature: -55°C ~ 155°C; Package / Case: 0402 (1005 Metric); Supplier Device Package: 0402; Size / Dimension: 0.039" L x 0.020" W (1.00mm x 0.50mm); Height - Seated (Max): 0.016" (0.40mm); Failure Rate: -; ComponentLink1URL: http://www.yageo.com/NewPortal/yageodocoutput?fileName=/pdf/R-Chip/PYu-RC_51_RoHS_P_0.pdf; ComponentLink1Description: http://www.yageo.com/NewPortal/yageodocoutput?fileName=/pdf/R-Chip/PYu-RC_51_RoHS_P_0.pdf
RGB = LED RGB-CLMVB-FKA: LED RGB CLEAR 4PLCC SMD; Manufacturer: Cree Inc.; Manufacturer Part Number: CLMVC-FKA-CL1D1L71BB7C3C3; Configuration: Common Anode; Lens Color: Colorless; Millicandela Rating: 337mcd Red, 420mcd Green, 84mcd Blue; Lens Style: Square with Flat Top; Voltage - Forward (Vf) (Typ): 2V Red, 3V Green, 3V Blue; Current - Test: 20mA Red, 10mA Green, 10mA Blue; Wavelength - Dominant: 622nm Red, 530nm Green, 470nm Blue; Supplier 1: Digi-Key; RoHS: RoHS Compliant; Category: Optoelectronics; Stock 1: 3423; Packaging: Cut Tape (CT); Part Status: Active; Color: Red, Green, Blue (RGB); Lens Transparency: Clear; Lens Size: -; Viewing Angle: -; Mounting Type: Surface Mount; Wavelength - Peak: -; Features: -; Package / Case: 4-SMD, J-Lead; Supplier Device Package: 4-PLCC; Size / Dimension: 2.00mm L x 2.00mm W; Height (Max): 1.00mm; ComponentLink1URL: https://www.cree.com/led-components/media/documents/1273-CLMVC-FKA.pdf; ComponentLink1Description: https://www.cree.com/led-components/media/documents/1273-CLMVC-FKA.pdf; Supplier Part Number 1: CLMVC-FKA-CL1D1L71BB7C3C3CT-ND; Pricing 1: 1=0.19, 10=0.178, 100=0.165, 1000=0.14746 (USD)
SW1 = PTS810 SJM 250 SMTR LFS: SWITCH TACTILE SPST-NO 0.05A 16V; MPN: DHT-4235A; Manufacturer: C&K; Manufacturer Part Number: KXT 331 LHS; Switch Function: Off-Mom; Contact Rating @ Voltage: 0.02A @ 15VDC; Actuator Type: Standard; Actuator Height off PCB, Vertical: 0.60mm; Actuator Orientation: Top Actuated; Outline: 3.00mm x 2.00mm; Illumination: Non-Illuminated; Operating Force: 240gf; Switch Travel: 0.13mm; Mechanical Life: 500,000 Cycles; Supplier 1: Digi-Key; RoHS: RoHS Compliant; Category: Switches; Stock 1: 220949; Packaging: Cut Tape (CT); Part Status: Active; Circuit: SPST-NO; Mounting Type: Surface Mount; Actuator Length, Right Angle: -; Termination Style: SMD (SMT) Tab; Illumination Type, Color: -; Illumination Voltage (Nominal): -; Ingress Protection: -; Features: -; Operating Temperature: -40°C ~ 85°C; Actuator Material: -; ComponentLink1URL: https://www.ckswitches.com/media/1465/kxt3.pdf; ComponentLink1Description: https://www.ckswitches.com/media/1465/kxt3.pdf; Supplier Part Number 1: CKN10502CT-ND; Pricing 1: 1=0.3, 10=0.287, 25=0.2768, 50=0.267, 100=0.2521, 250=0.23728, 500=0.2274, 1000=0.17302 (USD); ComponentLink2URL: https://www.ckswitches.com/media/1476/pts810.pdf; ComponentLink2Description: https://www.ckswitches.com/media/1476/pts810.pdf

## Nets that join several sheets
5V: FTDI (C6.2 L2.2 R1.1), Misc (C8.2 U2.3)
+1.2V: Misc (L4.1), FPGA (R8.1 R9.1)
+3.3V: FTDI (6 pins), Misc (10 pins), FPGA (7 pins)
GND: FTDI (26 pins), Misc (14 pins), FPGA (13 pins)
RAW_VCC: FTDI (D2.1), Misc (P2.24)
CDONE: FTDI (U1.19), FPGA (FPGA.7)
CRESET_B: FTDI (U1.20), FPGA (FPGA.8 R13.1 SW1.2)
FLASH_MISO: FTDI (U1.15), Misc (MEM.2 P1.3 P1.4), FPGA (FPGA.17)
FLASH_MOSI: FTDI (U1.14), Misc (MEM.5 P1.1 P1.2), FPGA (FPGA.14)
ICE_CLK: FTDI (OSC1.3 U1.1), FPGA (FPGA.35)
ICE_SCK: FTDI (U1.13), Misc (MEM.6 R4.1), FPGA (FPGA.15)
ICE_SS: FTDI (U1.17), Misc (MEM.1 R7.1), FPGA (FPGA.16)
IOB_2A_N: Misc (P3.3), FPGA (FPGA.47)
IOB_2A_P: Misc (P3.4), FPGA (FPGA.44)
IOB_4A_N: Misc (P3.7), FPGA (FPGA.48)
IOB_4A_P: Misc (P3.8), FPGA (FPGA.45)
IOB_6A: Misc (P2.13), FPGA (FPGA.2)
IOB_8A_N: Misc (P3.1), FPGA (FPGA.4)
IOB_8A_P: Misc (P3.2), FPGA (FPGA.3)
IOB_13B: Misc (P2.14), FPGA (FPGA.6)
IOB_16A: Misc (P2.15), FPGA (FPGA.9)
IOB_18A: Misc (P2.16), FPGA (FPGA.10)
IOB_20A: Misc (P2.17), FPGA (FPGA.11)
IOB_23B_N: Misc (P2.18), FPGA (FPGA.12)
IOB_23B_P: Misc (P2.2), FPGA (FPGA.21)
IOB_24A: Misc (P2.19), FPGA (FPGA.13)
IOB_25B_G3: Misc (P2.1), FPGA (FPGA.20)
IOB_29B: Misc (P2.21), FPGA (FPGA.19)
IOB_31B: Misc (P2.20), FPGA (FPGA.18)
IOT_37A_N: Misc (P2.4), FPGA (FPGA.25)
IOT_37A_P: Misc (P2.3), FPGA (FPGA.23)
IOT_39A_N: Misc (P2.6), FPGA (FPGA.27)
IOT_39A_P: Misc (P2.5), FPGA (FPGA.26)
IOT_43A_N: Misc (P2.7), FPGA (FPGA.31)
IOT_43A_P: Misc (P2.8), FPGA (FPGA.32)
IOT_44B_N: Misc (P2.9), FPGA (FPGA.34)
IOT_44B_P: Misc (P2.11), FPGA (FPGA.37)
IOT_49A_N: Misc (P2.10), FPGA (FPGA.36)
IOT_51A_N: Misc (P3.9), FPGA (FPGA.38)
IOT_51A_P: Misc (P3.10), FPGA (FPGA.42)